# Altium project CM4 IO_V1.10.PrjPcb (part 5 of 5)

## Sheet 12 40PIN_FAN.SchDoc: CM4 IO
size 297 x 209 mm; Page Create Date: March  8, 1995; Page Number: 12; Page Size: A4; Comment: radxa_1010; Page Count: 19; RevCode: V1.10; Doc: 12 40PIN/FAN; DsnPath: D:\WMS\黄工\[RC126]CM4_IO_V1.10\[RC126]_V1.10\CM4 IO_V1.10.DSN; SchematicName: CM4 IO V1.10; PageName: 12 40PIN/FAN; PageSize: A4; TopSchematic: True
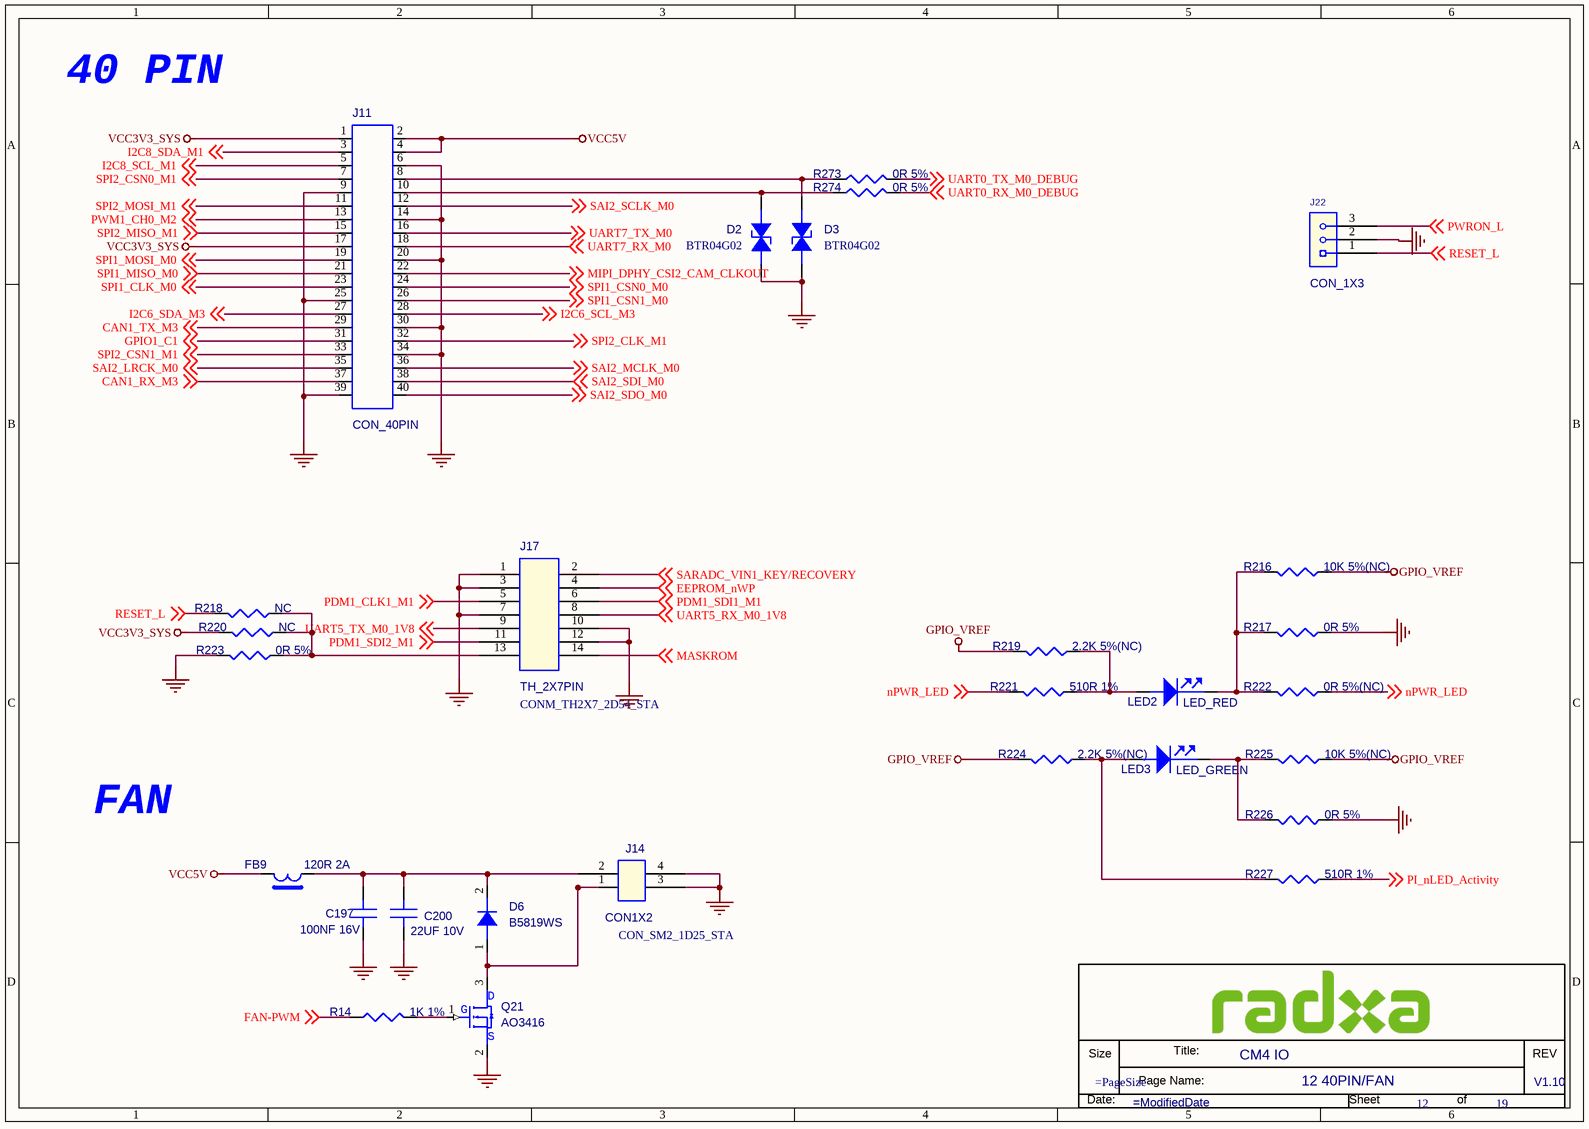
[diagram p17: 12 40PIN_FAN.SchDoc]

### Parts
(Parts that share a designator on the sheet are numbered #1, #2 ... from top to bottom, then left to right.)
*#18  Doc: 12 40PIN/FAN  RevCode: V1.10  Title: CM4 IO  Page Number: 12  Page Count: 19  (hidden comment: radxa_1010)  (graphical)
C197  100NF 16V  [C0201]
C200  22UF 10V  [C0603]
D2  BTR04G02  [DFN1006-2L]
D3  BTR04G02  [DFN1006-2L]
D6  B5819WS  [SOD_323]
FB9  120R 2A  [FB0402]
J11  CON_40PIN  [CON_TH20X2_2D54_STA]
J14  CON1X2  [CON_SM2_1D25_STA]
J17  TH_2X7PIN  [CONM_TH2X7_2D54_STA]
J22  CON_1X3  [CON_TH1X3_2D54_STA]
LED2  LED_RED  [LED_D0603]
LED3  LED_GREEN  [LED_D0603]
Q21  AO3416  [SOT_23]
R14  1K 1%  [R0402]
R216  10K 5%(NC)  [R0402]
R217  0R 5%  [R0402]
R218  NC  [R0402]
R219  2.2K 5%(NC)  [R0402]
R220  NC  [R0402]
R221  510R 1%  [R0402]
R222  0R 5%(NC)  [R0402]
R223  0R 5%  [R0402]
R224  2.2K 5%(NC)  [R0402]
R225  10K 5%(NC)  [R0402]
R226  0R 5%  [R0402]
R227  510R 1%  [R0402]
R273  0R 5%  [R0402]
R274  0R 5%  [R0402]

### Nets
GND: C197.2(B) C200.2(B) D2.2(CATHODE) D3.2(CATHODE) J11.6 J11.9 J11.14 J11.20 J11.25 J11.30 J11.34 J11.39 J14.3 J14.4 J17.1 J17.3 J17.7 J17.10 J17.12 J22.2 Q21.2(S) R217.2 R223.2 R226.2
GPIO_VREF: R216.2 R219.1 R224.1 R225.2
VCC3V3_SYS: J11.1 J11.17 R220.2
VCC5V: FB9.1 J11.2 J11.4
CAN1_RX_M3: J11.37 ; off-sheet CAN1_RX_M3
CAN1_TX_M3: J11.29 ; off-sheet CAN1_TX_M3
EEPROM_nWP: J17.4 ; off-sheet EEPROM_nWP
FAN-PWM: R14.1 ; off-sheet FAN-PWM
GPIO1_C1: J11.31 ; off-sheet GPIO1_C1
I2C6_SCL_M3: J11.28 ; off-sheet I2C6_SCL_M3
I2C6_SDA_M3: J11.27 ; off-sheet I2C6_SDA_M3
I2C8_SCL_M1: J11.5 ; off-sheet I2C8_SCL_M1
I2C8_SDA_M1: J11.3 ; off-sheet I2C8_SDA_M1
MASKROM: J17.14 ; off-sheet MASKROM
MIPI_DPHY_CSI2_CAM_CLKOUT: J11.22 ; off-sheet MIPI_DPHY_CSI2_CAM_CLKOUT
nPWR_LED: R221.1 R222.2 ; off-sheet nPWR_LED
PDM1_CLK1_M1: J17.5 ; off-sheet PDM1_CLK1_M1
PDM1_SDI1_M1: J17.6 ; off-sheet PDM1_SDI1_M1
PDM1_SDI2_M1: J17.11 ; off-sheet PDM1_SDI2_M1
PI_nLED_Activity: R227.2 ; off-sheet PI_nLED_Activity
PWM1_CH0_M2: J11.13 ; off-sheet PWM1_CH0_M2
PWRON_L: J22.3 ; off-sheet PWRON_L
RESET_L: J22.1 R218.2 ; off-sheet RESET_L
SAI2_LRCK_M0: J11.35 ; off-sheet SAI2_LRCK_M0
SAI2_MCLK_M0: J11.36 ; off-sheet SAI2_MCLK_M0
SAI2_SCLK_M0: J11.12 ; off-sheet SAI2_SCLK_M0
SAI2_SDI_M0: J11.38 ; off-sheet SAI2_SDI_M0
SAI2_SDO_M0: J11.40 ; off-sheet SAI2_SDO_M0
SARADC_VIN1_KEY/RECOVERY: J17.2 ; off-sheet SARADC_VIN1_KEY/RECOVERY
SPI1_CLK_M0: J11.23 ; off-sheet SPI1_CLK_M0
SPI1_CSN0_M0: J11.24 ; off-sheet SPI1_CSN0_M0
SPI1_CSN1_M0: J11.26 ; off-sheet SPI1_CSN1_M0
SPI1_MISO_M0: J11.21 ; off-sheet SPI1_MISO_M0
SPI1_MOSI_M0: J11.19 ; off-sheet SPI1_MOSI_M0
SPI2_CLK_M1: J11.32 ; off-sheet SPI2_CLK_M1
SPI2_CSN0_M1: J11.7 ; off-sheet SPI2_CSN0_M1
SPI2_CSN1_M1: J11.33 ; off-sheet SPI2_CSN1_M1
SPI2_MISO_M1: J11.15 ; off-sheet SPI2_MISO_M1
SPI2_MOSI_M1: J11.11 ; off-sheet SPI2_MOSI_M1
UART0_RX_M0_DEBUG: R274.2 ; off-sheet UART0_RX_M0_DEBUG
UART0_TX_M0_DEBUG: R273.2 ; off-sheet UART0_TX_M0_DEBUG
UART5_RX_M0_1V8: J17.8 ; off-sheet UART5_RX_M0_1V8
UART5_TX_M0_1V8: J17.9 ; off-sheet UART5_TX_M0_1V8
UART7_RX_M0: J11.18 ; off-sheet UART7_RX_M0
UART7_TX_M0: J11.16 ; off-sheet UART7_TX_M0
NetC197_1: C197.1(A) C200.1(A) D6.2(K) FB9.2 J14.2
NetD2_1: D2.1(ANODE) J11.10 R274.1
NetD3_1: D3.1(ANODE) J11.8 R273.1
NetD6_1: D6.1(A) J14.1 Q21.3(D)
NetJ17_13: J17.13 R218.1 R220.1 R223.1
NetLED2_1: LED2.1(ANODE) R219.2 R221.2
NetLED2_2: LED2.2(CATHODE) R216.1 R217.1 R222.1
NetLED3_1: LED3.1(ANODE) R224.2 R227.1
NetLED3_2: LED3.2(CATHODE) R225.1 R226.1
NetQ21_1: Q21.1(G) R14.2

### Notes on the sheet
- 40 PIN
- FAN
- (in symbol radxa_1010) Size; Title:; REV; Page Name:; Date:; Sheet; of

### Library data of the parts
C197 = C: SMD  0201  100NF  16V  X5R  ±20%  ROHS; PARTS: 1; Part Reference: C197; Part Number: A1C01.00099; OriginalSymbolOrigin: (0,30); PKG_TYPE: CAP2-100-250; LEVEL: STD; PINSWAP: (A,B); Value: 100NF 16V; Part Type: 陶瓷电容; PCB Footprint: C0201
C200 = C: SMD  0603  22UF  10V  X5R  ±20%  ROHS; PARTS: 1; Part Reference: C200; Part Number: A1C01.00015; OriginalSymbolOrigin: (0,30); PKG_TYPE: CAP2-100-250; LEVEL: STD; PINSWAP: (A,B); Value: 22UF 10V; Part Type: 陶瓷电容; PCB Footprint: C0603
D2 = ESD: SMD  编带  0402  BTR04G02  B-tron  ROHS; Part Reference: D2; Part Number: A1D02.00002; Parameter: ESD-台舟 ESD5341N-封装 esd0402; ID: DE-E0004; Preferred: 6715f349cd0bc5; Temp Coeff: -50℃ to +125℃; PCB Footprint: ESD_D0402; Value: BTR04G02; Part Type: 二极管-ESD管-桥堆-TVS管
D3 = ESD: SMD  编带  0402  BTR04G02  B-tron  ROHS; Part Reference: D3; Part Number: A1D02.00002; Parameter: ESD-台舟 ESD5341N-封装 esd0402; ID: DE-E0004; Temp Coeff: -50℃ to +125℃; Preferred: 6715f349cd0bc5; PCB Footprint: ESD_D0402; Value: BTR04G02; Part Type: 二极管-ESD管-桥堆-TVS管
D6 = DIODE_Dup1: SMD  编带  SOD-323  B5819WS  CJ  ROHS; Part Reference: D6; Manufacturer: 长电; Part Number: A1D02.00005; RK PN: B5819W; Priority: A; Temp Coeff: -55℃ ~ ＋150℃; PCB Footprint: SOD_323; Value: B5819WS; Part Type: 二极管-ESD管-桥堆-TVS管; Manufacturer PN: B5819W; Created by: JJJ
FB9 = BEAD: SMD  0402  FB120R  2A  ±25%  ROHS; Part Reference: FB9; Part Number: A1L09.00004; Preferred: 6715f349cd0bc5; Temp Coeff: -55℃ to +125℃; PCB Footprint: FB0402; Value: 120R 2A; Part Type: 贴片磁珠
J11 = CON_TH2X20: DIP  排针座  2*20PIN  180度  2.54mm脚距  中间朔高2.5mm  针长一端6.1mm  另一端3.0mm  彩色  PH2.54  2*20P  彩印 L=11.6/3.0  国意英  ROHS; Part Reference: J11; Part Number: A1J01.00012; OriginalSymbolOrigin: (-100,550); Preferred: 6715f349cd0bc5; Temp Coeff: -40℃ to +105℃; ANGLE: ?; ASSEMBLY: ?; GENDER: ?; LATCHING: ?; MAX_CURRENT: ?; MAX_VOLTAGE: ?; NV_NAME: ?; NV_PN: ?; PACK_TYPE: ?; PATH: ?; PITCH: ?; PLACEMENT_NOTE: ?; REFLOW: ?; SHROUDED: ?; SKU: COMMON; Value: CON_40PIN; Part Type: 排座; PCB Footprint: CON_TH20X2_2D54_STA
J14 = CON_1X2: SMD  母座  1*2PIN  90度  立贴  1.25mm脚距  9T  X9821WVS-02-9TSN  白色  星坤  ROHS; Part Reference: J14; Part Number: A1J01.00089; Temp Coeff: -25℃ to +85℃; Preferred: 6715f352cd0bcd; Value: CON1X2; Part Type: 连接座; PCB Footprint: CON_SM2_1D25_STA
J17 = TH_2X7PIN: DIP  排针座  2*7PIN  180度  2.54mm脚距  中间朔高2.5mm  针长一端6.1mm  另一端3.0mm  黑色  PH2.54 2*7P L=11.6/3.0 S/T  国意英  ROHS; Part Reference: J17; Part Number: A1J02.00017; Preferred: 6715f349cd0bc5; Value: TH_2X7PIN; Part Type: 排座; PCB Footprint: CONM_TH2X7_2D54_STA
J22 = CON_1X3: DIP  排针座  1*3PIN  180度  2.54mm脚距  中间朔高2.5mm  针长一端6.1mm  另一端3.0mm  材质LCP  黑色  PH2.54 1*3P L=11.6/3.0  国意英  ROHS; Part Reference: J22; Part Number: A1J02.00013; OriginalSymbolOrigin: (-50,50); Temp Coeff: -40°C to +85°C; Preferred: 6715f349cd0bc5; ANGLE: ?; ASSEMBLY: ?; GENDER: ?; LATCHING: ?; MAX_CURRENT: ?; MAX_VOLTAGE: ?; NV_NAME: ?; NV_PN: ?; PACK_TYPE: ?; PATH: ?; PITCH: ?; PLACEMENT_NOTE: ?; REFLOW: ?; SHROUDED: ?; SKU: COMMON; Value: CON_1X3; Part Type: 排座; PCB Footprint: CON_TH1X3_2D54_STA
LED2 = LED: SMD  编带  0603  发红光  单色  mcd=150  IF=20mA  无色散光  EY-PB0603RC-010F  恩域光电  ROHS; Part Reference: LED2; Part Number: A1D03.00003; RK PN: LED_GREEN; Priority: A; Temp Coeff: -40℃ to +85℃; Preferred: 6715f349cd0bc5; PCB Footprint: LED_D0603; Value: LED_RED; Part Type: 发光二极管; Created by: JJJ
LED3 = LED: SMD  编带  0603  发绿光  单色  mcd=150  IF=20mA  无色散光  EY-TB0603GC-010F  恩域光电  ROHS; Part Reference: LED3; Part Number: A1D03.00002; Priority: A; Temp Coeff: -40℃ to +85℃; PCB Footprint: LED_D0603; Value: LED_GREEN; RK PN: LED_GREEN; Part Type: 发光二极管; Created by: JJJ
Q21 = MOSFET_NPN: SMD  编带  SOT-23-3L  AO3416  N沟道  AOS  ROHS; Part Reference: Q21; Part Number: A1D01.00010; Temp Coeff: -55℃ to ＋150℃; Value: AO3416; Part Type: 三极管-MOS管; PCB Footprint: SOT_23
R14 = R: SMD  0201  1K  1/20W  ±1%  ROHS; Part Reference: R14; Part Number: A1R01.00111; PCB Footprint: R0201; Preferred: 6715f349cd0bc5; Value: 1K 1%; Part Type: 贴片电阻
R216 = R: SMD  0201  10K  1/20W  ±5%  ROHS; Part Reference: R216; Part Number: A1R01.00012; PCB Footprint: R0201; Temp Coeff: -55℃ to +125℃; Preferred: 6715f349cd0bc5; Value: 10K 5%(NC); Part Type: 贴片电阻
R217 = R: SMD  0201  0R  1/20W  ±5%  ROHS; Part Reference: R217; Part Number: A1R01.00027; PCB Footprint: R0201; Preferred: 6715f349cd0bc5; Temp Coeff: -55℃ to +125℃; Value: 0R 5%; Part Type: 贴片电阻
R218 = R: SMD  0201  0R  1/20W  ±5%  ROHS; Part Reference: R218; Part Number: A1R01.00027; PCB Footprint: R0201; Preferred: 6715f349cd0bc5; Temp Coeff: -55℃ to +125℃; Value: NC; Part Type: 贴片电阻
R219 = R: SMD  0201  2.2K  1/20W  ±5%  ROHS; Part Reference: R219; Part Number: A1R01.00016; PCB Footprint: R0201; Preferred: 6715f349cd0bc5; Temp Coeff: -55℃ to +125℃; Value: 2.2K 5%(NC); Part Type: 贴片电阻
R220 = R: SMD  0201  10K  1/20W  ±5%  ROHS; Part Reference: R220; Part Number: A1R01.00012; PCB Footprint: R0201; Preferred: 6715f349cd0bc5; Temp Coeff: -55℃ to +125℃; Value: NC; Part Type: 贴片电阻
R221 = R: SMD  0201  2.2K  1/20W  ±5%  ROHS; Part Reference: R221; Part Number: A1R01.00016; PCB Footprint: R0201; Preferred: 6715f349cd0bc5; Temp Coeff: -55℃ to +125℃; Value: 510R 1%; Part Type: 贴片电阻
R222 = R: SMD  0201  0R  1/20W  ±5%  ROHS; Part Reference: R222; Part Number: A1R01.00027; PCB Footprint: R0201; Temp Coeff: -55℃ to +125℃; Preferred: 6715f349cd0bc5; Value: 0R 5%(NC); Part Type: 贴片电阻
R223 = R: SMD  0201  0R  1/20W  ±5%  ROHS; Part Reference: R223; Part Number: A1R01.00027; PCB Footprint: R0201; Temp Coeff: -55℃ to +125℃; Preferred: 6715f349cd0bc5; Value: 0R 5%; Part Type: 贴片电阻
R224 = R: SMD  0201  2.2K  1/20W  ±5%  ROHS; Part Reference: R224; Part Number: A1R01.00016; PCB Footprint: R0201; Temp Coeff: -55℃ to +125℃; Preferred: 6715f349cd0bc5; Value: 2.2K 5%(NC); Part Type: 贴片电阻
R225 = R: SMD  0201  10K  1/20W  ±5%  ROHS; Part Reference: R225; Part Number: A1R01.00012; PCB Footprint: R0201; Temp Coeff: -55℃ to +125℃; Preferred: 6715f349cd0bc5; Value: 10K 5%(NC); Part Type: 贴片电阻
R226 = R: SMD  0201  0R  1/20W  ±5%  ROHS; Part Reference: R226; Part Number: A1R01.00027; PCB Footprint: R0201; Preferred: 6715f349cd0bc5; Temp Coeff: -55℃ to +125℃; Value: 0R 5%; Part Type: 贴片电阻
R227 = R: SMD  0201  0R  1/20W  ±5%  ROHS; Part Reference: R227; Part Number: A1R01.00027; PCB Footprint: R0201; Preferred: 6715f349cd0bc5; Temp Coeff: -55℃ to +125℃; Value: 510R 1%; Part Type: 贴片电阻
R273 = R: SMD  0201  0R  1/20W  ±5%  ROHS; Part Reference: R273; Part Number: A1R01.00027; PCB Footprint: R0201; Temp Coeff: -55℃ to +125℃; Preferred: 6715f349cd0bc5; Value: 0R 5%; Part Type: 贴片电阻
R274 = R: SMD  0201  0R  1/20W  ±5%  ROHS; Part Reference: R274; Part Number: A1R01.00027; PCB Footprint: R0201; Temp Coeff: -55℃ to +125℃; Preferred: 6715f349cd0bc5; Value: 0R 5%; Part Type: 贴片电阻
*#18 = radxa_1010: Page Create Date: March  8, 1995; Page Size: =PageSize; Page Modify Date: =ModifiedDate

## Nets that join several sheets
3V3_S0: 06 Audio-CODEC (FB14.1 FB15.1), 11 Power-DC IN (C157.1 C158.1 Q12.3 R164.1), 14 ETHERNET (R238.1 R248.2), 17 MIPI_CSI_RX (10 pins)
5V_S0: 07 Audio SPK (FB22.1), 11 Power-DC IN (C297.1 C298.1 Q24.3 R342.1), 17 MIPI_CSI_RX (FB5.2)
+5V_INPUT: 04 TYPEC (9 pins), 05 UFS (C202.1 C241.1 U26.4 U30.4), 08 VCC-Connetor (6 pins), 11 Power-DC IN (17 pins), 13 HDMI TX_RTC (D8.1), 16 MIPI DSI TX (FB2.1 R255.1), 18 USB2_USB3 (C196.1 R277.1 U25.5), 19 PCIE (C211.1 C212.1 R278.2 U29.5)
GND: 04 TYPEC (38 pins), 05 UFS (48 pins), 06 Audio-CODEC (26 pins), 07 Audio SPK (18 pins), 08 VCC-Connetor (21 pins), 09 High Speed-Connector (34 pins), 10 IO-Connector (27 pins), 11 Power-DC IN (46 pins), 13 HDMI TX_RTC (24 pins), 14 ETHERNET (15 pins), 15 MicroSD Card (18 pins), 16 MIPI DSI TX (35 pins), 17 MIPI_CSI_RX (33 pins), 18 USB2_USB3 (30 pins), 19 PCIE (28 pins), 12 40PIN_FAN (24 pins)
GPIO_VREF: 08 VCC-Connetor (R214.1 R215.1 U33.78), 12 40PIN_FAN (R216.2 R219.1 R224.1 R225.2)
VCC3V3_SYS: 11 Power-DC IN (9 pins), 13 HDMI TX_RTC (D29.2 R16.1), 15 MicroSD Card (C173.1 Q14.2 R213.2 R231.1), 16 MIPI DSI TX (R254.1), 12 40PIN_FAN (J11.1 J11.17 R220.2)
VCC5V: 11 Power-DC IN (C78.1 C79.1 J4.4 R18.2), 12 40PIN_FAN (FB9.1 J11.2 J11.4)
VCC_1V8_S0: 08 VCC-Connetor (R215.2 U33.88 U33.90), 16 MIPI DSI TX (C178.1 C179.1 R233.1), 17 MIPI_CSI_RX (8 pins)
VCC_1V8_S3: 05 UFS (C227.1 C228.1 Q22.2 R321.1), 10 IO-Connector (J3.73), 13 HDMI TX_RTC (R263.1)
VCC_3V3_S0: 04 TYPEC (C269.1 R351.1 U36.3 U36.4), 05 UFS (R303.1 R331.1), 08 VCC-Connetor (R214.2 U33.84 U33.86), 10 IO-Connector (R3.2), 11 Power-DC IN (R204.1 R327.1 R357.1), 19 PCIE (R288.1)
VDDA_1V2_S0: 05 UFS (R323.1), 10 IO-Connector (J3.69)
AUD_LINEOUT_L: 06 Audio-CODEC (U27.15), 07 Audio SPK (C289.1)
AUD_LINEOUT_R: 06 Audio-CODEC (U27.14), 07 Audio SPK (C296.1)
CAM1_GPIO: 08 VCC-Connetor (U33.97), 17 MIPI_CSI_RX (J10.5)
CAM_GPIO: 10 IO-Connector (J3.39), 17 MIPI_CSI_RX (J9.5)
CAN1_RX_M3: 08 VCC-Connetor (U33.24), 12 40PIN_FAN (J11.37)
CAN1_TX_M3: 08 VCC-Connetor (U33.34), 12 40PIN_FAN (J11.29)
CM4_PWR_TEST: 10 IO-Connector (J3.92), 11 Power-DC IN (R2.1)
DP_TX_AUXN_SBU2: 04 TYPEC (C250.1), 10 IO-Connector (J3.6)
DP_TX_AUXP_SBU1: 04 TYPEC (C249.1), 10 IO-Connector (J3.4)
EEPROM_nWP: 08 VCC-Connetor (U33.20), 12 40PIN_FAN (J17.4)
EXT_RST: 08 VCC-Connetor (U33.100), 13 HDMI TX_RTC (D30.1 R265.1)
FAN-PWM: 10 IO-Connector (J3.84), 12 40PIN_FAN (R14.1)
GPIO1_C1: 08 VCC-Connetor (U33.30), 12 40PIN_FAN (J11.31)
GPIO3_D6_1V8: 08 VCC-Connetor (U33.73), 11 Power-DC IN (R326.1 R356.1)
HDMI_TX0N: 09 High Speed-Connector (U33.184), 13 HDMI TX_RTC (J5.9 U19.4 U19.7)
HDMI_TX0P: 09 High Speed-Connector (U33.182), 13 HDMI TX_RTC (J5.7 U19.5 U19.6)
HDMI_TX1N: 09 High Speed-Connector (U33.178), 13 HDMI TX_RTC (J5.6 U18.1 U18.10)
HDMI_TX1P: 09 High Speed-Connector (U33.176), 13 HDMI TX_RTC (J5.4 U18.2 U18.9)
HDMI_TX2N: 09 High Speed-Connector (U33.172), 13 HDMI TX_RTC (J5.3 U18.4 U18.7)
HDMI_TX2P: 09 High Speed-Connector (U33.170), 13 HDMI TX_RTC (J5.1 U18.5 U18.6)
HDMI_TX3N: 09 High Speed-Connector (U33.190), 13 HDMI TX_RTC (J5.12 U19.1 U19.10)
HDMI_TX3P: 09 High Speed-Connector (U33.188), 13 HDMI TX_RTC (J5.10 U19.2 U19.9)
HDMI_TX_CEC_PORT: 09 High Speed-Connector (U33.151), 13 HDMI TX_RTC (D14.1 J5.13)
HDMI_TX_SCL_PORT: 09 High Speed-Connector (U33.200), 13 HDMI TX_RTC (D12.1 J5.15)
HDMI_TX_SDA_PORT: 09 High Speed-Connector (U33.199), 13 HDMI TX_RTC (D11.1 J5.16)
HDMITX_HPDIN/HDMITX_SBDN: 09 High Speed-Connector (U33.153), 13 HDMI TX_RTC (D9.1 J5.19)
HDMITX_SBDP: 09 High Speed-Connector (U33.149), 13 HDMI TX_RTC (D10.1 J5.14)
HP_DET_L: 06 Audio-CODEC (C1.1 R19.1), 10 IO-Connector (J3.86)
I2C0_SCL_M1_TP: 08 VCC-Connetor (U33.80), 16 MIPI DSI TX (R256.1), 17 MIPI_CSI_RX (J9.3)
I2C0_SDA_M1_TP: 08 VCC-Connetor (U33.82), 16 MIPI DSI TX (R258.1), 17 MIPI_CSI_RX (J9.2)
I2C2_SCL_M0_CC_RTC: 10 IO-Connector (J3.7), 13 HDMI TX_RTC (U22.6)
I2C2_SDA_M0_CC_RTC: 10 IO-Connector (J3.9), 13 HDMI TX_RTC (U22.5)
I2C3_SCL_M0_Audio: 06 Audio-CODEC (R29.1), 10 IO-Connector (J3.43)
I2C3_SDA_M0_Audio: 06 Audio-CODEC (R109.1), 10 IO-Connector (J3.45)
I2C5_SCL_M3_1V8: 09 High Speed-Connector (U33.147), 17 MIPI_CSI_RX (J16.24)
I2C5_SDA_M3_1V8: 09 High Speed-Connector (U33.145), 17 MIPI_CSI_RX (J16.25)
I2C6_SCL_M3: 04 TYPEC (U36.6), 08 VCC-Connetor (U33.35), 17 MIPI_CSI_RX (J10.3), 12 40PIN_FAN (J11.28)
I2C6_SDA_M3: 04 TYPEC (U36.7), 08 VCC-Connetor (U33.36), 17 MIPI_CSI_RX (J10.2), 12 40PIN_FAN (J11.27)
I2C8_SCL_M1: 08 VCC-Connetor (U33.56), 12 40PIN_FAN (J11.5)
I2C8_SDA_M1: 08 VCC-Connetor (U33.58), 12 40PIN_FAN (J11.3)
LCD_light_EN: 10 IO-Connector (J3.78), 16 MIPI DSI TX (R246.1)
LCD_PWM: 10 IO-Connector (J3.94), 16 MIPI DSI TX (R247.1)
LCD_PWREN_H: 10 IO-Connector (J3.13), 16 MIPI DSI TX (R262.1)
LCD_RESET: 10 IO-Connector (J3.80), 16 MIPI DSI TX (R250.1)
MASKROM: 08 VCC-Connetor (U33.93), 12 40PIN_FAN (J17.14)
MIPI_CAM3_PDN_1V8: 09 High Speed-Connector (U33.143), 17 MIPI_CSI_RX (J16.23)
MIPI_CAM3_PDN_3V3: 10 IO-Connector (J3.15), 17 MIPI_CSI_RX (Q2.3 R8.1 R10.2)
MIPI_CAM3_RST_3V3: 10 IO-Connector (J3.17), 17 MIPI_CSI_RX (Q3.3 R11.1 R13.2)
MIPI_CSI0_CAM_CLKOUT_1V8: 10 IO-Connector (J3.63), 17 MIPI_CSI_RX (Q20.2 R271.1 R272.1)
MIPI_CSI1_CAM_CLKOUT_1V8: 10 IO-Connector (J3.65), 17 MIPI_CSI_RX (Q19.2 R212.1 R266.1)
MIPI_CSI3_CAM_CLKOUT_1V8: 10 IO-Connector (J3.59), 17 MIPI_CSI_RX (J16.20)
MIPI_DPHY_CSI1_RX_CLKN: 09 High Speed-Connector (U33.140), 17 MIPI_CSI_RX (J10.8)
MIPI_DPHY_CSI1_RX_CLKP: 09 High Speed-Connector (U33.142), 17 MIPI_CSI_RX (J10.7)
MIPI_DPHY_CSI1_RX_D0N: 09 High Speed-Connector (U33.128), 17 MIPI_CSI_RX (J10.14)
MIPI_DPHY_CSI1_RX_D0P: 09 High Speed-Connector (U33.130), 17 MIPI_CSI_RX (J10.13)
MIPI_DPHY_CSI1_RX_D1N: 09 High Speed-Connector (U33.134), 17 MIPI_CSI_RX (J10.11)
MIPI_DPHY_CSI1_RX_D1P: 09 High Speed-Connector (U33.136), 17 MIPI_CSI_RX (J10.10)
MIPI_DPHY_CSI2_CAM_CLKOUT: 08 VCC-Connetor (U33.41), 12 40PIN_FAN (J11.22)
MIPI_DPHY_CSI2_RX_CLKN: 09 High Speed-Connector (U33.169), 17 MIPI_CSI_RX (J9.8)
MIPI_DPHY_CSI2_RX_CLKP: 09 High Speed-Connector (U33.171), 17 MIPI_CSI_RX (J9.7)
MIPI_DPHY_CSI2_RX_D0N: 09 High Speed-Connector (U33.157), 17 MIPI_CSI_RX (J9.14)
MIPI_DPHY_CSI2_RX_D0P: 09 High Speed-Connector (U33.159), 17 MIPI_CSI_RX (J9.13)
MIPI_DPHY_CSI2_RX_D1N: 09 High Speed-Connector (U33.163), 17 MIPI_CSI_RX (J9.11)
MIPI_DPHY_CSI2_RX_D1P: 09 High Speed-Connector (U33.165), 17 MIPI_CSI_RX (J9.10)
MIPI_DPHY_CSI3_RX_CLKN: 09 High Speed-Connector (U33.127), 17 MIPI_CSI_RX (J16.17)
MIPI_DPHY_CSI3_RX_CLKP: 09 High Speed-Connector (U33.129), 17 MIPI_CSI_RX (J16.18)
MIPI_DPHY_CSI3_RX_D0N: 09 High Speed-Connector (U33.115), 17 MIPI_CSI_RX (J16.14)
MIPI_DPHY_CSI3_RX_D0P: 09 High Speed-Connector (U33.117), 17 MIPI_CSI_RX (J16.15)
MIPI_DPHY_CSI3_RX_D1N: 09 High Speed-Connector (U33.121), 17 MIPI_CSI_RX (J16.11)
MIPI_DPHY_CSI3_RX_D1P: 09 High Speed-Connector (U33.123), 17 MIPI_CSI_RX (J16.12)
MIPI_DPHY_CSI4_RX_CLKN: 09 High Speed-Connector (U33.104), 17 MIPI_CSI_RX (J16.8)
MIPI_DPHY_CSI4_RX_CLKP: 09 High Speed-Connector (U33.106), 17 MIPI_CSI_RX (J16.9)
MIPI_DPHY_CSI4_RX_D0N: 09 High Speed-Connector (U33.133), 17 MIPI_CSI_RX (J16.5)
MIPI_DPHY_CSI4_RX_D0P: 09 High Speed-Connector (U33.135), 17 MIPI_CSI_RX (J16.6)
MIPI_DPHY_CSI4_RX_D1N: 09 High Speed-Connector (U33.139), 17 MIPI_CSI_RX (J16.2)
MIPI_DPHY_CSI4_RX_D1P: 09 High Speed-Connector (U33.141), 17 MIPI_CSI_RX (J16.3)
MIPI_DPHY_DSI_TX_CLKN: 09 High Speed-Connector (U33.187), 16 MIPI DSI TX (U20.13)
MIPI_DPHY_DSI_TX_CLKP: 09 High Speed-Connector (U33.189), 16 MIPI DSI TX (U20.14)
MIPI_DPHY_DSI_TX_D0N: 09 High Speed-Connector (U33.175), 16 MIPI DSI TX (U20.7)
MIPI_DPHY_DSI_TX_D0P: 09 High Speed-Connector (U33.177), 16 MIPI DSI TX (U20.8)
MIPI_DPHY_DSI_TX_D1N: 09 High Speed-Connector (U33.181), 16 MIPI DSI TX (U20.10)
MIPI_DPHY_DSI_TX_D1P: 09 High Speed-Connector (U33.183), 16 MIPI DSI TX (U20.11)
MIPI_DPHY_DSI_TX_D2N: 09 High Speed-Connector (U33.193), 16 MIPI DSI TX (U20.16)
MIPI_DPHY_DSI_TX_D2P: 09 High Speed-Connector (U33.195), 16 MIPI DSI TX (U20.17)
MIPI_DPHY_DSI_TX_D3N: 09 High Speed-Connector (U33.194), 16 MIPI DSI TX (U20.19)
MIPI_DPHY_DSI_TX_D3P: 09 High Speed-Connector (U33.196), 16 MIPI DSI TX (U20.20)
nPWR_LED: 08 VCC-Connetor (U33.95), 12 40PIN_FAN (R221.1 R222.2)
PCIE0_CLKREQn_M0: 09 High Speed-Connector (U33.102), 19 PCIE (R296.2)
PCIE0_PERSTn: 09 High Speed-Connector (U33.109), 19 PCIE (R295.2)
PCIE0_PWREN_H: 10 IO-Connector (J3.76), 19 PCIE (R7.1)
PCIE0_SOC_REFCLKN: 09 High Speed-Connector (U33.112), 19 PCIE (J30.53)
PCIE0_SOC_REFCLKP: 09 High Speed-Connector (U33.110), 19 PCIE (J30.55)
PCIE0_SOC_RXN: 09 High Speed-Connector (U33.118), 19 PCIE (R293.1)
PCIE0_SOC_RXP: 09 High Speed-Connector (U33.116), 19 PCIE (R294.1)
PCIE0_SOC_TXN: 09 High Speed-Connector (U33.124), 19 PCIE (C221.1)
PCIE0_SOC_TXP: 09 High Speed-Connector (U33.122), 19 PCIE (C222.1)
PCIE0_WAKEN_M0: 10 IO-Connector (J3.37), 19 PCIE (R297.2)
PCIE1_RXN/USB3_OTG1_SSRXN: 10 IO-Connector (J3.60), 18 USB2_USB3 (D40.2 USB1.5)
PCIE1_RXP/USB3_OTG1_SSRXP: 10 IO-Connector (J3.58), 18 USB2_USB3 (D36.2 USB1.6)
PCIE1_TXN/USB3_OTG1_SSTXN: 10 IO-Connector (J3.54), 18 USB2_USB3 (C204.1)
PCIE1_TXP/USB3_OTG1_SSTXP: 10 IO-Connector (J3.52), 18 USB2_USB3 (C205.1)
PDM1_CLK1_M1: 08 VCC-Connetor (U33.96), 12 40PIN_FAN (J17.5)
PDM1_SDI1_M1: 08 VCC-Connetor (U33.94), 12 40PIN_FAN (J17.6)
PDM1_SDI2_M1: 09 High Speed-Connector (U33.111), 12 40PIN_FAN (J17.11)
PHY1_LED0_Y1: 08 VCC-Connetor (U33.19), 14 ETHERNET (R242.2)
PHY1_LED1_G: 08 VCC-Connetor (U33.17), 14 ETHERNET (D16.1 R252.1)
PHY1_LED2_Y: 08 VCC-Connetor (U33.15), 14 ETHERNET (D15.1 R237.2 R241.1)
PHY1_MDI0+: 08 VCC-Connetor (U33.12), 14 ETHERNET (L16.1)
PHY1_MDI0-: 08 VCC-Connetor (U33.10), 14 ETHERNET (L16.2)
PHY1_MDI1+: 08 VCC-Connetor (U33.4), 14 ETHERNET (L17.1)
PHY1_MDI1-: 08 VCC-Connetor (U33.6), 14 ETHERNET (L17.2)
PHY1_MDI2+: 08 VCC-Connetor (U33.11), 14 ETHERNET (L18.1)
PHY1_MDI2-: 08 VCC-Connetor (U33.9), 14 ETHERNET (L18.2)
PHY1_MDI3+: 08 VCC-Connetor (U33.3), 14 ETHERNET (L19.1)
PHY1_MDI3-: 08 VCC-Connetor (U33.5), 14 ETHERNET (L19.2)
PI_nLED_Activity: 08 VCC-Connetor (U33.21), 12 40PIN_FAN (R227.2)
PWM1_CH0_M2: 08 VCC-Connetor (U33.48), 12 40PIN_FAN (J11.13)
PWRON_L: 08 VCC-Connetor (U33.99), 12 40PIN_FAN (J22.3)
REF_CLK0_OUT_1V8: 10 IO-Connector (J3.57), 17 MIPI_CSI_RX (J16.22)
RESET_L: 08 VCC-Connetor (U33.92), 12 40PIN_FAN (J22.1 R218.2)
SAI1_LRCK_M0: 06 Audio-CODEC (U27.7), 10 IO-Connector (J3.19)
SAI1_MCLK_M0: 06 Audio-CODEC (U27.1), 10 IO-Connector (J3.23)
SAI1_SCLK_M0: 06 Audio-CODEC (U27.5), 10 IO-Connector (J3.25)
SAI1_SDI0_M0: 06 Audio-CODEC (R276.1), 10 IO-Connector (J3.27)
SAI1_SDO0_M0: 06 Audio-CODEC (U27.6), 10 IO-Connector (J3.29)
SAI2_LRCK_M0: 08 VCC-Connetor (U33.26), 12 40PIN_FAN (J11.35)
SAI2_MCLK_M0: 08 VCC-Connetor (U33.29), 12 40PIN_FAN (J11.36)
SAI2_SCLK_M0: 08 VCC-Connetor (U33.49), 12 40PIN_FAN (J11.12)
SAI2_SDI_M0: 08 VCC-Connetor (U33.27), 12 40PIN_FAN (J11.38)
SAI2_SDO_M0: 08 VCC-Connetor (U33.25), 12 40PIN_FAN (J11.40)
SARADC_VIN1_KEY/RECOVERY: 08 VCC-Connetor (U33.89), 12 40PIN_FAN (J17.2)
SARADC_VIN3_HP_HOOK_1V8: 06 Audio-CODEC (C281.1 R305.2 R319.1), 10 IO-Connector (J3.51)
SARADC_VIN7_1V8: 10 IO-Connector (J3.49), 11 Power-DC IN (R178.1)
SDMMC0_CLK: 08 VCC-Connetor (U33.57), 15 MicroSD Card (C170.1 D21.2 J8.5)
SDMMC0_CMD: 08 VCC-Connetor (U33.62), 15 MicroSD Card (D17.2 J8.3)
SDMMC0_D0: 08 VCC-Connetor (U33.63), 15 MicroSD Card (D20.2 J8.7)
SDMMC0_D1: 08 VCC-Connetor (U33.67), 15 MicroSD Card (D19.2 J8.8)
SDMMC0_D2/JTAG_TCK_M0: 08 VCC-Connetor (U33.69), 15 MicroSD Card (D22.2 J8.1)
SDMMC0_D3/JTAG_TMS_M0: 08 VCC-Connetor (U33.61), 15 MicroSD Card (D23.2 J8.2)
SDMMC0_DET_L: 08 VCC-Connetor (U33.76), 15 MicroSD Card (R228.1)
SDMMC0_PWREN_H: 08 VCC-Connetor (U33.75), 15 MicroSD Card (R230.1)
SPI1_CLK_M0: 08 VCC-Connetor (U33.38), 12 40PIN_FAN (J11.23)
SPI1_CSN0_M0: 08 VCC-Connetor (U33.39), 12 40PIN_FAN (J11.24)
SPI1_CSN1_M0: 08 VCC-Connetor (U33.37), 12 40PIN_FAN (J11.26)
SPI1_MISO_M0: 08 VCC-Connetor (U33.40), 12 40PIN_FAN (J11.21)
SPI1_MOSI_M0: 08 VCC-Connetor (U33.44), 12 40PIN_FAN (J11.19)
SPI2_CLK_M1: 08 VCC-Connetor (U33.31), 12 40PIN_FAN (J11.32)
SPI2_CSN0_M1: 08 VCC-Connetor (U33.54), 12 40PIN_FAN (J11.7)
SPI2_CSN1_M1: 08 VCC-Connetor (U33.50), 12 40PIN_FAN (J11.33)
SPI2_MISO_M1: 08 VCC-Connetor (U33.46), 12 40PIN_FAN (J11.15)
SPI2_MOSI_M1: 08 VCC-Connetor (U33.28), 12 40PIN_FAN (J11.11)
SPK_CTL_H: 07 Audio SPK (R333.1 U31.1 U32.1), 10 IO-Connector (J3.96)
SSRX1N_DP_TX_D0N: 04 TYPEC (R346.1), 10 IO-Connector (J3.12)
SSRX1P_DP_TX_D0P: 04 TYPEC (R347.1), 10 IO-Connector (J3.10)
SSRX2N_DP_TX_D2N: 04 TYPEC (R348.1), 10 IO-Connector (J3.24)
SSRX2P_DP_TX_D2P: 04 TYPEC (R349.1), 10 IO-Connector (J3.22)
SSTX1N_DP_TX_D1N: 04 TYPEC (C251.1), 10 IO-Connector (J3.18)
SSTX1P_DP_TX_D1P: 04 TYPEC (C252.1), 10 IO-Connector (J3.16)
SSTX2N_DP_TX_D3N: 04 TYPEC (C253.1), 10 IO-Connector (J3.30)
SSTX2P_DP_TX_D3P: 04 TYPEC (C254.1), 10 IO-Connector (J3.28)
TP_DET: 10 IO-Connector (J3.82), 16 MIPI DSI TX (R234.1)
TP_INT_L: 10 IO-Connector (J3.88), 16 MIPI DSI TX (R259.1)
TP_RST_L: 10 IO-Connector (J3.90), 16 MIPI DSI TX (R260.1)
TYPEC5V_PWREN_H: 04 TYPEC (R355.1 U37.D3), 10 IO-Connector (J3.11)
TYPEC_DPTX_AUX_PUPDCTL1: 04 TYPEC (R338.1), 10 IO-Connector (J3.5)
TYPEC_DPTX_AUX_PUPDCTL2: 04 TYPEC (R339.1), 10 IO-Connector (J3.3)
UART0_RX_M0_DEBUG: 08 VCC-Connetor (U33.51), 12 40PIN_FAN (R274.2)
UART0_TX_M0_DEBUG: 08 VCC-Connetor (U33.55), 12 40PIN_FAN (R273.2)
UART5_RX_M0_1V8: 08 VCC-Connetor (U33.16), 12 40PIN_FAN (J17.8)
UART5_TX_M0_1V8: 08 VCC-Connetor (U33.18), 12 40PIN_FAN (J17.9)
UART7_RX_M0: 08 VCC-Connetor (U33.45), 12 40PIN_FAN (J11.18)
UART7_TX_M0: 08 VCC-Connetor (U33.47), 12 40PIN_FAN (J11.16)
UFS_FSPI_PLUG: 05 UFS (J2.1 R15.1), 10 IO-Connector (J3.97)
UFS_REFCLK: 05 UFS (J12.42), 10 IO-Connector (J3.93)
UFS_RSTn: 05 UFS (J12.57), 10 IO-Connector (J3.95)
UFS_RX_D0N: 05 UFS (J12.62), 10 IO-Connector (J3.83)
UFS_RX_D0P: 05 UFS (J12.63), 10 IO-Connector (J3.81)
UFS_RX_D1N: 05 UFS (J12.59), 10 IO-Connector (J3.91)
UFS_RX_D1P: 05 UFS (J12.60), 10 IO-Connector (J3.89)
UFS_TX_D0N: 05 UFS (J12.37), 10 IO-Connector (J3.79)
UFS_TX_D0P: 05 UFS (J12.36), 10 IO-Connector (J3.77)
UFS_TX_D1N: 05 UFS (J12.40), 10 IO-Connector (J3.87)
UFS_TX_D1P: 05 UFS (J12.39), 10 IO-Connector (J3.85)
USB2_OTG0_DM: 04 TYPEC (L31.4 R343.1), 09 High Speed-Connector (U33.103)
USB2_OTG0_DP: 04 TYPEC (L31.3 R345.1), 09 High Speed-Connector (U33.105)
USB20_1DM: 10 IO-Connector (J3.48), 18 USB2_USB3 (FB8.1 R282.2)
USB20_1DP: 10 IO-Connector (J3.46), 18 USB2_USB3 (FB8.2 R283.2)
USB20_2DM: 10 IO-Connector (J3.66), 18 USB2_USB3 (L23.1 R299.1)
USB20_2DP: 10 IO-Connector (J3.64), 18 USB2_USB3 (L23.2 R301.1)
USB20_3DM: 10 IO-Connector (J3.72), 18 USB2_USB3 (L24.1 R300.1)
USB20_3DP: 10 IO-Connector (J3.70), 18 USB2_USB3 (L24.2 R302.1)
USB_PWR_EN: 10 IO-Connector (J3.33), 18 USB2_USB3 (R279.2)
USBCC_INT_L: 04 TYPEC (R351.2 U36.5), 10 IO-Connector (J3.35)